# EAGLE design schematic1 (EAGLE 6.1)
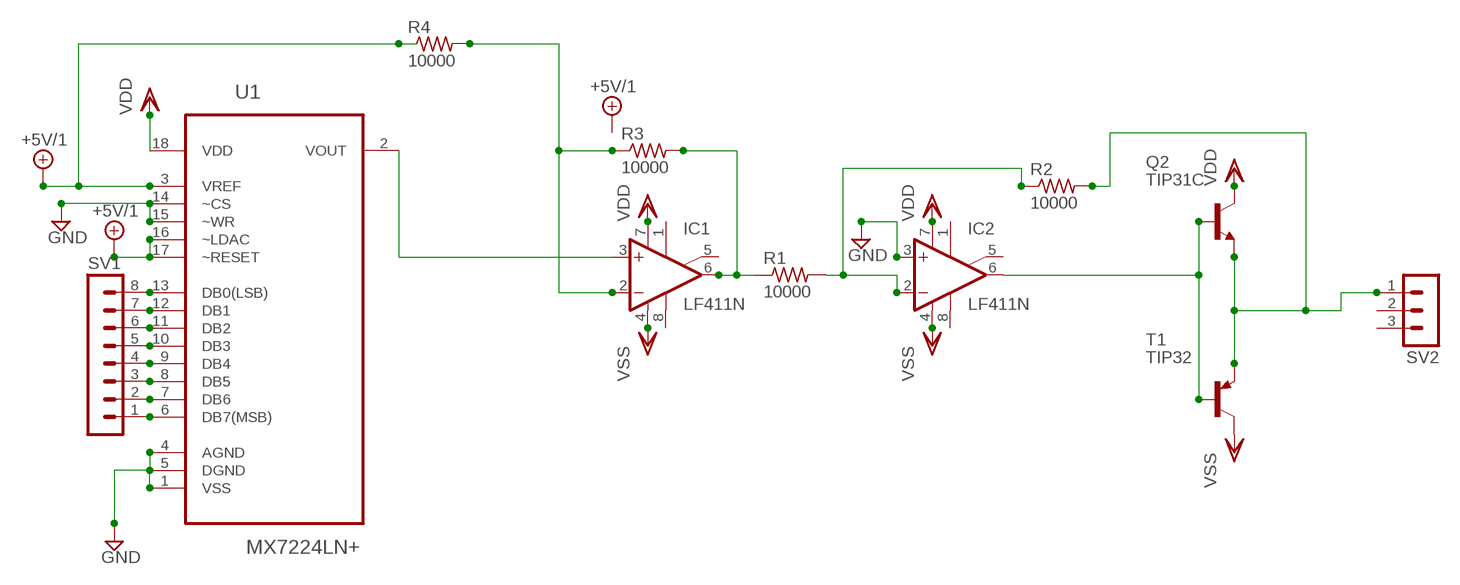
[diagram p0: schematic, sheet 1]

## Parts
IC1  LF411N  [DIL08]
IC2  LF411N  [DIL08]
Q2  TIP31C  [TO220]
R1  10000  R-US_0204/7  [0204/7]
R2  10000  R-US_0204/7  [0204/7]
R3  10000  R-US_0204/7  [0204/7]
R4  10000  R-US_0204/7  [0204/7]
SV1  MA08-1W  [MA08-1W]
SV2  MA03-1  [MA03-1]
T1  TIP32  [TO220]
U1  MX7224LN+  [DIP254P762X457-18]

## Nets
+5V/1: R4.1 U1.3(VREF) U1.16(~LDAC) U1.17(~RESET)
GND: IC2.3(+IN) U1.1(VSS) U1.4(AGND) U1.5(DGND) U1.14(~CS) U1.15(~WR)
N$1: IC1.6(OUT) R1.1 R3.2
N$2: IC2.2(-IN) R1.2 R2.1
N$3: IC2.6(OUT) Q2.1(B) T1.1(B)
N$4: IC1.3(+IN) U1.2(VOUT)
N$5: IC1.2(-IN) R3.1 R4.2
N$6: SV1.1 U1.6(DB7(MSB))
N$7: SV1.2 U1.7(DB6)
N$8: SV1.3 U1.8(DB5)
N$9: SV1.4 U1.9(DB4)
N$10: SV1.5 U1.10(DB3)
N$11: SV1.6 U1.11(DB2)
N$12: SV1.7 U1.12(DB1)
N$13: SV1.8 U1.13(DB0(LSB))
O0: Q2.3(E) R2.2 SV2.1 T1.3(E)
VDD: IC1.7(V+) IC2.7(V+) Q2.2(C) U1.18(VDD)
VSS: IC1.4(V-) IC2.4(V-) T1.2(C)
Unconnected: IC1.1(ON1) IC1.5(ON2) IC1.8(OPT) IC2.1(ON1) IC2.5(ON2) IC2.8(OPT) SV2.2 SV2.3

## Library data of the parts
IC1 IC2 = linear:LF411: OP AMP
Q2 = transistor-npn:TIP31C*: NPN Transistor
R1-R3 = rcl:R-US_: RESISTOR, American symbol
R4 = rcl:R-US_: RESISTOR, American symbol; RES: 10000
SV1 = con-lstb:MA08-1W: PIN HEADER; OC_FARNELL: unknown; OC_NEWARK: unknown
SV2 = con-lstb:MA03-1: PIN HEADER; OC_FARNELL: unknown; OC_NEWARK: unknown
T1 = transistor:TIP32: PNP Transistor Medium Power Linear Switching Applications Source: http://onsemi.com
U1 = Maxim_By_element14_Batch_1:MX7224LN+: 8-bit DAC; MPN: MX7224LN+; OC_FARNELL: -; OC_NEWARK: 67K7160; PACKAGE: PDIP-18; SUPPLIER: Maxim

## Board
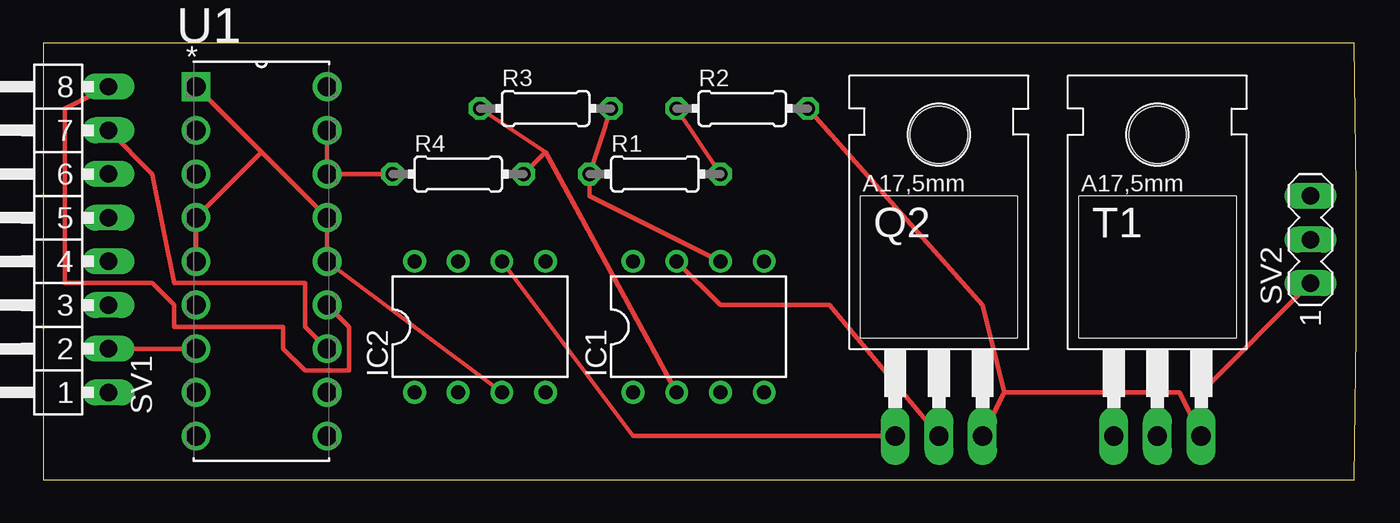
[diagram p1: board, top side]
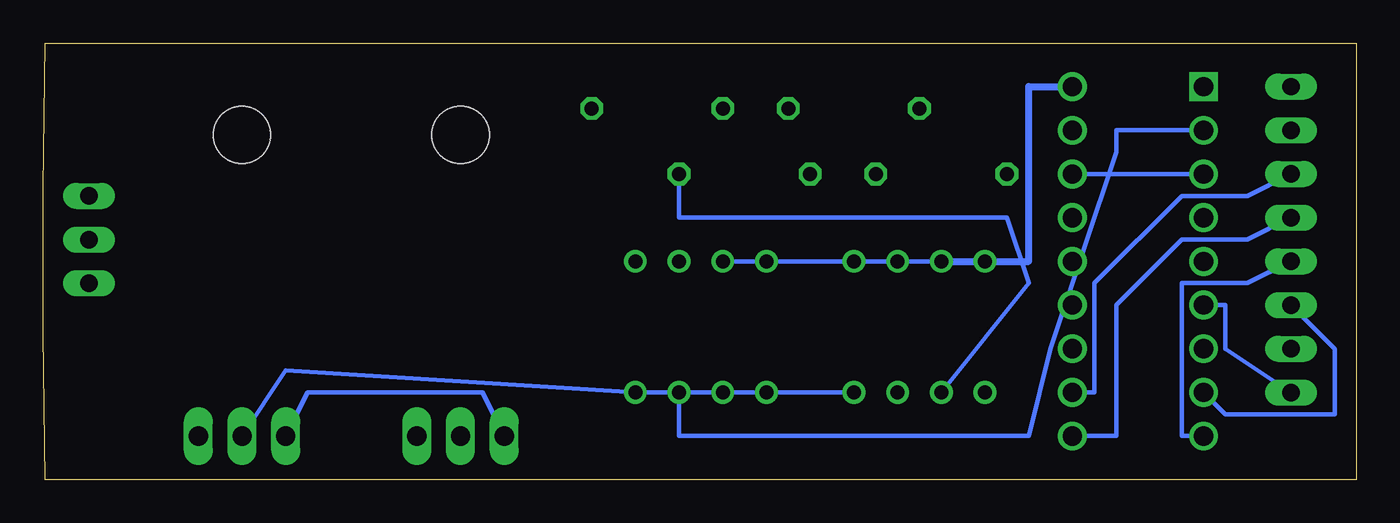
[diagram p2: board, bottom side, seen from below]

Size 76.34 x 25.4 mm. Coordinates in mm from the lower left corner, seen from the top.
Outline: 0,0 76.2,0 arc3 76.2,25.4 0,25.4 0,0
Copper layers (1*16): Top 0.035mm / dielectric 1.5mm / Bottom 0.035mm
Design rules: minimum track width 10mil, minimum drill 24mil, track to track 8mil, track to pad 8mil, pad to pad 8mil, via to via 8mil, smd to smd 8mil, copper to edge 40mil, drill to drill 8mil, minimum pad ring 10mil, minimum via ring 8mil, stop-mask expansion 4mil, vias tented up to drill 0mil, thermal gap 10mil

### Footprints (pad centres in the part's own frame; a part is rotated, then mirrored left to right if it is on the bottom)
DIL08 = drill 0.813 pad 1.27: 1 -3.81,-3.81; 2 -1.27,-3.81; 3 1.27,-3.81; 4 3.81,-3.81; 5 3.81,3.81; 6 1.27,3.81; 7 -1.27,3.81; 8 -3.81,3.81
TO220 = drill 1.118 long: 1 -2.54,-6.35; 2 0,-6.35; 3 2.54,-6.35 | hole 3.302: 0,11.176
0204/7 = drill 0.813 octagon: 1 -3.81,0; 2 3.81,0
MA08-1W = drill 1.016 long: 1 -8.89,0; 2 -6.35,0; 3 -3.81,0; 4 -1.27,0; 5 1.27,0; 6 3.81,0; 7 6.35,0; 8 8.89,0
MA03-1 = drill 1.016 long: 1 -2.54,0; 2 0,0; 3 2.54,0
DIP254P762X457-18 = drill 1.118 square: 1 -7.62,20.32 | drill 1.118: 2 -7.62,17.78; 3 -7.62,15.24; 4 -7.62,12.7; 5 -7.62,10.16; 6 -7.62,7.62; 7 -7.62,5.08; 8 -7.62,2.54; 9 -7.62,0; 10 0,0; 11 0,2.54; 12 0,5.08; 13 0,7.62; 14 0,10.16; 15 0,12.7; 16 0,15.24; 17 0,17.78; 18 0,20.32

### Placement (x,y rotation side)
IC1  38.1,8.89 0 top
IC2  25.4,8.89 0 top
Q2  52.07,8.89 0 top
R1  35.56,17.78 0 top
R2  40.64,21.59 0 top
R3  29.21,21.59 0 top
R4  24.13,17.78 0 top
SV1  3.81,13.97 90 top
SV2  73.66,13.97 90 top
T1  64.77,8.89 0 top
U1  16.51,2.54 0 top

### Tracks (layer width: path | path; a pad name or v marks a point on that pad's centre or on a via)
+5V/1
  Top 0.254: R4.1 U1.16 U1.17
  Bottom 0.254: U1.16 U1.3
GND
  Top 0.254: U1.5 U1.4 12.7,19.05 | IC2.3 U1.14 U1.15 12.7,19.05 | 12.7,19.05 U1.1
N$1
  Top 0.254: R3.2 R1.1 31.75,16.51 IC1.6
N$2
  Top 0.254: R1.2 R2.1
  Bottom 0.254: IC2.2 19.05,11.43 20.32,15.24 39.37,15.24 R1.2
N$3
  Top 0.254: IC2.6 34.29,2.54 Q2.1
  Bottom 0.254: T1.1 60.96,5.08 50.8,5.08 Q2.1
N$4
  Bottom 0.254: IC1.3 39.37,2.54 19.05,2.54 17.78,7.62 13.97,19.05 13.97,20.32 U1.2
N$5
  Top 0.254: R3.1 29.21,19.05 | 29.21,19.05 R4.2 | 29.21,19.05 IC1.2
N$6
  Bottom 0.254: SV1.1 7.62,7.62 7.62,10.16 U1.6
N$7
  Top 0.254: U1.7 SV1.2
N$8
  Bottom 0.254: SV1.3 1.27,7.62 1.27,3.81 7.62,3.81 U1.8
N$9
  Bottom 0.254: SV1.4 6.35,11.43 10.16,11.43 10.16,2.54 U1.9
N$10
  Bottom 0.254: SV1.5 6.35,13.97 10.16,13.97 13.97,10.16 13.97,2.54 U1.10
N$11
  Bottom 0.254: SV1.6 6.35,16.51 10.16,16.51 15.24,11.43 15.24,5.08 U1.11
N$12
  Top 0.254: SV1.7 6.35,17.78 7.62,11.43 15.24,11.43 15.24,8.89 U1.12
N$13
  Top 0.254: SV1.8 1.27,21.59 1.27,11.43 6.35,11.43 7.62,10.16 7.62,8.89 13.97,8.89 13.97,7.62 15.24,6.35 17.78,6.35 17.78,8.89 U1.13
O0
  Top 0.254: R2.2 54.61,10.16 55.88,5.08 | Q2.3 55.88,5.08 | 55.88,5.08 66.04,5.08 T1.3 67.31,5.08 SV2.1
VDD
  Top 0.254: Q2.2 45.72,10.16 39.37,10.16 IC1.7
  Bottom 0.254: IC1.7 IC2.7
  Bottom 0.406: IC2.7 19.05,12.7 19.05,22.86 U1.18
VSS
  Bottom 0.254: IC2.4 IC1.4 62.23,6.35 T1.2